# EAGLE schematic Thermocouple_pcb (EAGLE 9.6.2)
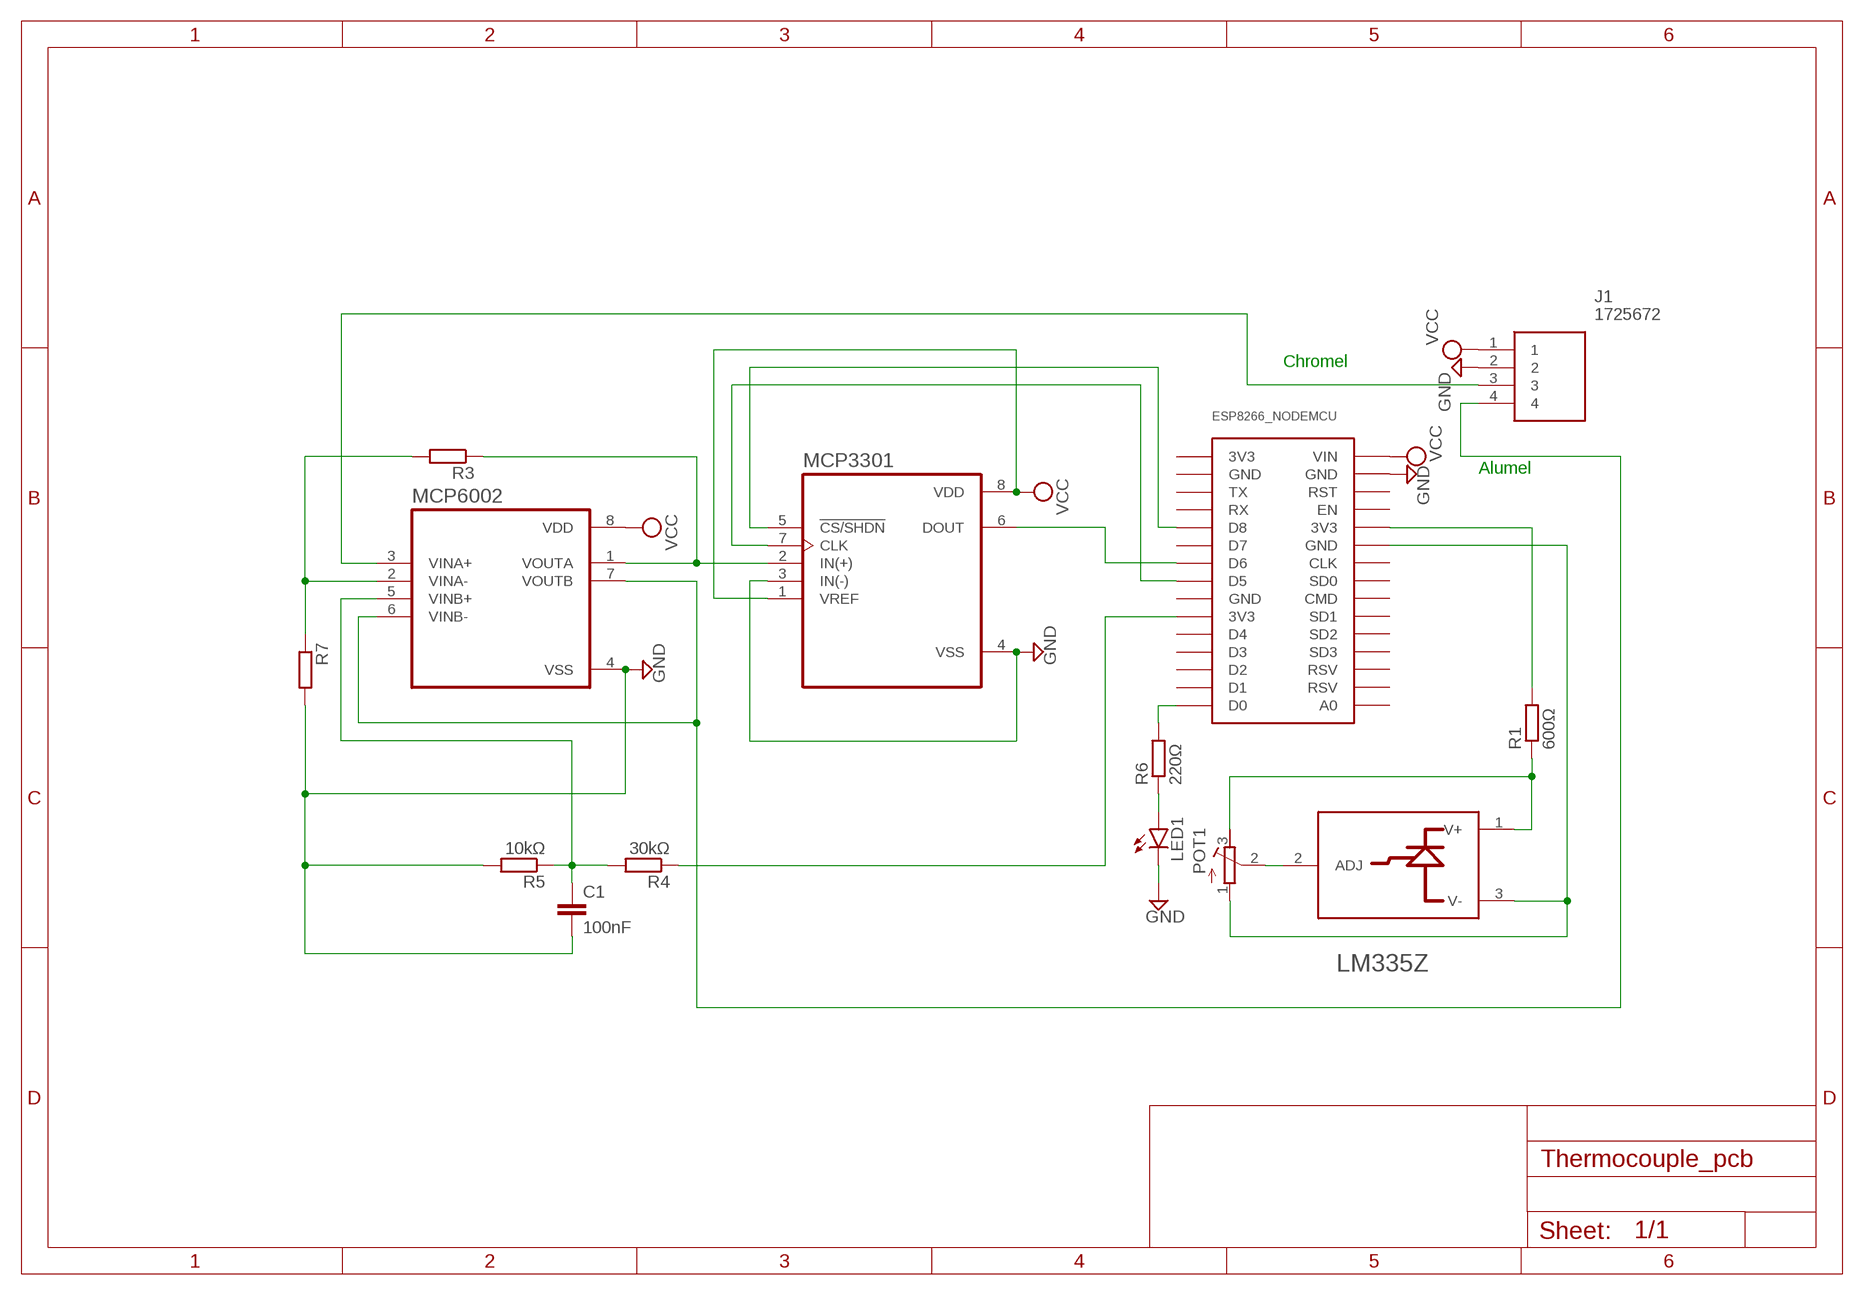
[diagram p0: schematic, sheet 1]

## Parts
C1  100nF  C-EU050-025X075  [C050-025X075]
ESP8266_NODEMCU  NODEMCU_ESP8266  [NODEMCU_ESP8266]
J1  1725672  [1725672-4-2.54]
LED1  LED5MM  [LED5MM]
LM335Z  STMICROELECTRONICS_LM335ZSTMICROELECTRONICS_LM335Z_0_0  [STMICROELECTRONICS_LM335Z_0]
MCP3301  MCP3301-CI/P  [DIP787W46P254L927H533Q8]
MCP6002  MCP6002-I/P  [DIP787W46P254L927H533Q8]
POT1  R-TRIMM74W  [RTRIM74W]
R1  600Ω  R-EU_0204/7  [0204/7]
R3  R-EU_0204/7  [0204/7]
R4  30kΩ  R-EU_0204/7  [0204/7]
R5  10kΩ  R-EU_0204/7  [0204/7]
R6  220Ω  R-EU_0204/7  [0204/7]
R7  R-EU_0204/7  [0204/7]

## Nets
GND: C1.2 ESP8266_NODEMCU.GND@4(GND) J1.2 LED1.K(C) MCP3301.3(IN(-)) MCP3301.4(VSS) MCP6002.4(VSS) R5.2 R7.2
N$1: ESP8266_NODEMCU.D5 MCP3301.7(CLK)
N$2: ESP8266_NODEMCU.GND@3(GND) LM335Z.3(V-) POT1.1(A)
N$3: ESP8266_NODEMCU.D6 MCP3301.6(DOUT)
N$4: ESP8266_NODEMCU.D8 MCP3301.5(!CS/SHDN)
N$5: MCP3301.2(IN(+)) MCP6002.1(VOUTA) R3.1
N$6: LED1.A R6.1
N$7: C1.1 MCP6002.5(VINB+) R4.2 R5.1
N$8: ESP8266_NODEMCU.3V3@3(3V3) R1.2
N$9: J1.3 MCP6002.3(VINA+)
N$10: LM335Z.1(V+) POT1.3(E) R1.1
N$11: LM335Z.2(ADJ) POT1.2(S)
N$12: J1.4 MCP6002.6(VINB-) MCP6002.7(VOUTB)
N$13: ESP8266_NODEMCU.3V3@2(3V3) R4.1
N$14: MCP6002.2(VINA-) R3.2 R7.1
N$15: ESP8266_NODEMCU.D0 R6.2
VCC: ESP8266_NODEMCU.VIN J1.1 MCP3301.1(VREF) MCP3301.8(VDD) MCP6002.8(VDD)
Unconnected: ESP8266_NODEMCU.A0 ESP8266_NODEMCU.CLK ESP8266_NODEMCU.CMD ESP8266_NODEMCU.D1 ESP8266_NODEMCU.D2 ESP8266_NODEMCU.D3 ESP8266_NODEMCU.D4 ESP8266_NODEMCU.D7 ESP8266_NODEMCU.EN ESP8266_NODEMCU.RST ESP8266_NODEMCU.RSV1(RSV) ESP8266_NODEMCU.RSV2(RSV) ESP8266_NODEMCU.RX ESP8266_NODEMCU.SD1 ESP8266_NODEMCU.SD2 ESP8266_NODEMCU.SD3 ESP8266_NODEMCU.SDO(SD0) ESP8266_NODEMCU.TX

## Notes on the sheet
- Chromel
- Alumel

## Power pins joined to a net without a drawn wire
3V3: ESP8266_NODEMCU.3V3@1(3V3)
GND: ESP8266_NODEMCU.GND@1(GND) ESP8266_NODEMCU.GND@2(GND)

## Library data of the parts
C1 = rcl:C-EU: CAPACITOR, European symbol; SPICEPREFIX: C
ESP8266_NODEMCU = nodemcu_esp8266:NODEMCU_ESP8266: Node MCU V2 (ESP8266) Created by Harish
J1 = 1725672:1725672: 4 way vertical PCB terminal,6A 63V Phoenix Contact Non-Fused Terminal Block, 4 Way, Solder Terminals, 26 ??? 20 AWG Through Hole, Nylon, 63 V Source: <a href="https://www.phoenixcontact.com/online/portal/us?uri=pxc-oc-itemdetail:pid=1725672&library=usen&tab=1.pdf"> Datasheet </a> Check availability <https://pricing.snapeda.com/parts/17%2025%2067%202/Phoenix%20Contact/view-part?ref=eda>; AVAILABILITY: In Stock; DESCRIPTION: ROHS / BORNIER FIXE CI 1RX4C / TYPE MPT 0-5/ 4-2-54 / BOX 50 PCS; MF: Phoenix Contact; MP: 17 25 67 2; PACKAGE: None; PRICE: None
LED1 = led:LED: LED OSRAM: - CHIPLED LG R971, LG N971, LY N971, LG Q971, LY Q971, LO R971, LY R971 LH N974, LH R974 LS Q976, LO Q976, LY Q976 LO Q996 - Hyper CHIPLED LW Q18S LB Q993, LB Q99A, LB R99A - SideLED LS A670, LO A670, LY A670, LG A670, LP A670 LB A673, LV A673, LT A673, LW A673 LH A674 LY A675 LS A676, LA A676, LO A676, LY A676, LW A676 LS A679, LY A679, LG A679 - Hyper Micro SIDELED® LS Y876, LA Y876, LO Y876, LY Y876 LT Y87S - SmartLED LW L88C, LW L88S LB L89C, LB L89S, LG L890 LS L89K, LO L89K, LY L89K LS L896, LA L896, LO L896, LY L896 - TOPLED LS T670, LO T670, LY T670, LG T670, LP T670 LSG T670, LSP T670, LSY T670, LOP T670, LYG T670 LG T671, LOG T671, LSG T671 LB T673, LV T673, LT T673, LW T673 LH T674 LS T676, LA T676, LO T676, LY T676, LB T676, LH T676, LSB T676, LW T676 LB T67C, LV T67C, LT T67C, LS T67K, LO T67K, LY T67K, LW E67C LS E67B, LA E67B, LO E67B, LY E67B, LB E67C, LV E67C, LT E67C LW T67C LS T679, LY T679, LG T679 LS T770, LO T770, LY T770, LG T770, LP T770 LB T773, LV T773, LT T773, LW T773 LH T774 LS E675, LA E675, LY E675, LS T675 LS T776, LA T776, LO T776, LY T776, LB T776 LHGB T686 LT T68C, LB T68C - Hyper Mini TOPLED® LB M676 - Mini TOPLED Santana® LG M470 LS M47K, LO M47K, LY M47K Source: http://www.osram.convergy.de LUXEON: - LUMILED® LXK2-PW12-R00, LXK2-PW12-S00, LXK2-PW14-U00, LXK2-PW14-V00 LXK2-PM12-R00, LXK2-PM12-S00, LXK2-PM14-U00 LXK2-PE12-Q00, LXK2-PE12-R00, LXK2-PE12-S00, LXK2-PE14-T00, LXK2-PE14-U00 LXK2-PB12-K00, LXK2-PB12-L00, LXK2-PB12-M00, LXK2-PB14-N00, LXK2-PB14-P00, LXK2-PB14-Q00 LXK2-PR12-L00, LXK2-PR12-M00, LXK2-PR14-Q00, LXK2-PR14-R00 LXK2-PD12-Q00, LXK2-PD12-R00, LXK2-PD12-S00 LXK2-PH12-R00, LXK2-PH12-S00 LXK2-PL12-P00, LXK2-PL12-Q00, LXK2-PL12-R00 Source: www.luxeon.com KINGBRIGHT: KA-3528ASYC Source: www.kingbright.com
LM335Z = LM335Z_st:STMICROELECTRONICS_LM335Z: Precision temperature sensor; CENTROID_NOT_SPECIFIED: No; DATASHEET: http://www.st.com/content/ccc/resource/technical/document/datasheet/04/fa/9d/16/39/87/44/8d/CD00000459.pdf/files/CD00000459.pdf/jcr:content/translations/en.CD00000459.pdf; DIGIKEY_DESCRIPTION: IC SENSOR TEMP ANLG VOLT TO-92-3; DIGIKEY_PART_NUMBER: 497-1584-ND; IPC_LAND_PATTERN_NAME: TO-92; LEAD_FREE: yes; MF: STMicroelectronics; MOUSER_PART_NUMBER: 511-LM335Z; MPN: LM335Z; PACKAGE: TO-92-3; PREFIX: U; ROHS: yes; TEMPERATURE_RANGE_HIGH: +100°C; TEMPERATURE_RANGE_LOW: -40°C
MCP3301 = MCP3301-CI_P:MCP3301-CI/P: Check availability <https://pricing.snapeda.com/parts/MCP3301-CI/P/Microchip/view-part?ref=eda>; AVAILABILITY: In Stock; DESCRIPTION: 13 Bit Analog to Digital Converter 1 Input 1 SAR 8-PDIP; MF: Microchip; MP: MCP3301-CI/P; PACKAGE: DIP-8 Microchip; PRICE: None; PURCHASE-URL: https://pricing.snapeda.com/search/part/MCP3301-CI/P/?ref=eda
MCP6002 = MCP6002-I_P:MCP6002-I/P: Check availability <https://pricing.snapeda.com/parts/MCP6002-I/P/Microchip/view-part?ref=eda>; AVAILABILITY: In Stock; DESCRIPTION: General Purpose Amplifier 2 Circuit Rail-to-Rail 8-PDIP; MF: Microchip; MP: MCP6002-I/P; PACKAGE: DIP-8 Microchip; PRICE: None; PURCHASE-URL: https://pricing.snapeda.com/search/part/MCP6002-I/P/?ref=eda
POT1 = rcl:R-TRIMM: Trimm resistor; SPICEMODEL: X; SPICEPREFIXL: POT
R1 R3-R7 = rcl:R-EU_: RESISTOR, European symbol; SPICEPREFIX: R